# Altium schematic sheet QSPI.SchDoc: QSPI
size A4; Date: 9/24/2014; Author: P.A.; CompanyName: STMicroelectronics; Organization: Microcontrollers Division; Address1: 12, Rue Jules HOROWITZ; Address2: 38019 Grenoble; Address3: FRANCE; DocumentNumber: 10; Revision: B-07; SheetNumber: 10; SheetTotal: 13; Project: STM32F469I-DISCO
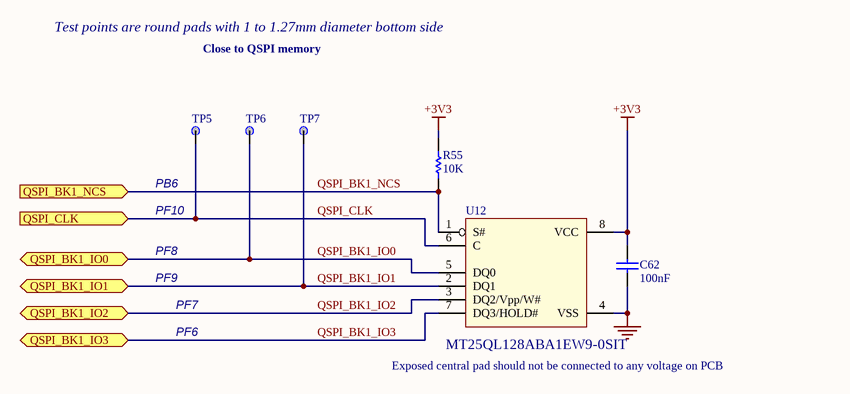
[diagram p0: QSPI.SchDoc]

## Parts
C62  100nF  [0402C]
R55  10K  [0402R]
TP5  TP  [TP_C40]  (value not drawn)
TP6  TP  [TP_C40]  (value not drawn)
TP7  TP  [TP_C40]  (value not drawn)
U12  MT25QL128ABA1EW9-0SIT  [DFN8_1R27_6X8_TP4R8X5R8]

## Ports
QSPI_BK1_IO0 (bidir), QSPI_BK1_IO1 (bidir), QSPI_BK1_IO2 (bidir), QSPI_BK1_IO3 (bidir), QSPI_BK1_NCS (in), QSPI_CLK (in)

## Nets
+3V3: C62.1 R55.2 U12.8(VCC)
GND: C62.2 U12.4(VSS)
QSPI_BK1_IO0: TP6.1 U12.5(DQ0) ; port QSPI_BK1_IO0
QSPI_BK1_IO1: TP7.1 U12.2(DQ1) ; port QSPI_BK1_IO1
QSPI_BK1_IO2: U12.3(DQ2/Vpp/W#) ; port QSPI_BK1_IO2
QSPI_BK1_IO3: U12.7(DQ3/HOLD#) ; port QSPI_BK1_IO3
QSPI_BK1_NCS: R55.1 U12.1(S#) ; port QSPI_BK1_NCS
QSPI_CLK: TP5.1 U12.6(C) ; port QSPI_CLK

## Notes on the sheet
- Test points are round pads with 1 to 1.27mm diameter bottom side
- Close to QSPI memory
- (near TP5) PB6
- PF10
- PF8
- PF9
- PF7
- PF6
- (near U12) Exposed central pad should not be connected to any voltage on PCB
- Title:
- Project:
- Size:
- Revision:
- Variant:
- A4
- -
- Date:
- Reference:
- Sheet:
- of

## Library data of the parts
C62 = Cap: Capacitor; Value: 10nF; Ordered by: Subcon; Published: 8-Jun-2000; Revision: July-2002: Re-released for DXP Platform.; Publisher: Altium Limited
R55 = Res_10K_1%_0402: Resistor; Manuf_Part_1: RC0402FR-0710KL; Manuf_1: YAGEO; Ordered by: Subcon; Value: 10K; Order: RC0402FR-0710KL; ECCN_US/EU: n/a
TP5-TP7 = TP: Ordered by: Subcon
U12 = N25Q128A13EF840E: 128Mb, 3V, Multiple I/O Serial Flash Memory, Quad/Dual; Manuf_1: MICRON; Ordered by: Subcon; Manuf_Part_1: MT25QL128ABA1EW9-0SIT